# EAGLE schematic Nutrient Control Board-B1 (EAGLE 9.3.2)
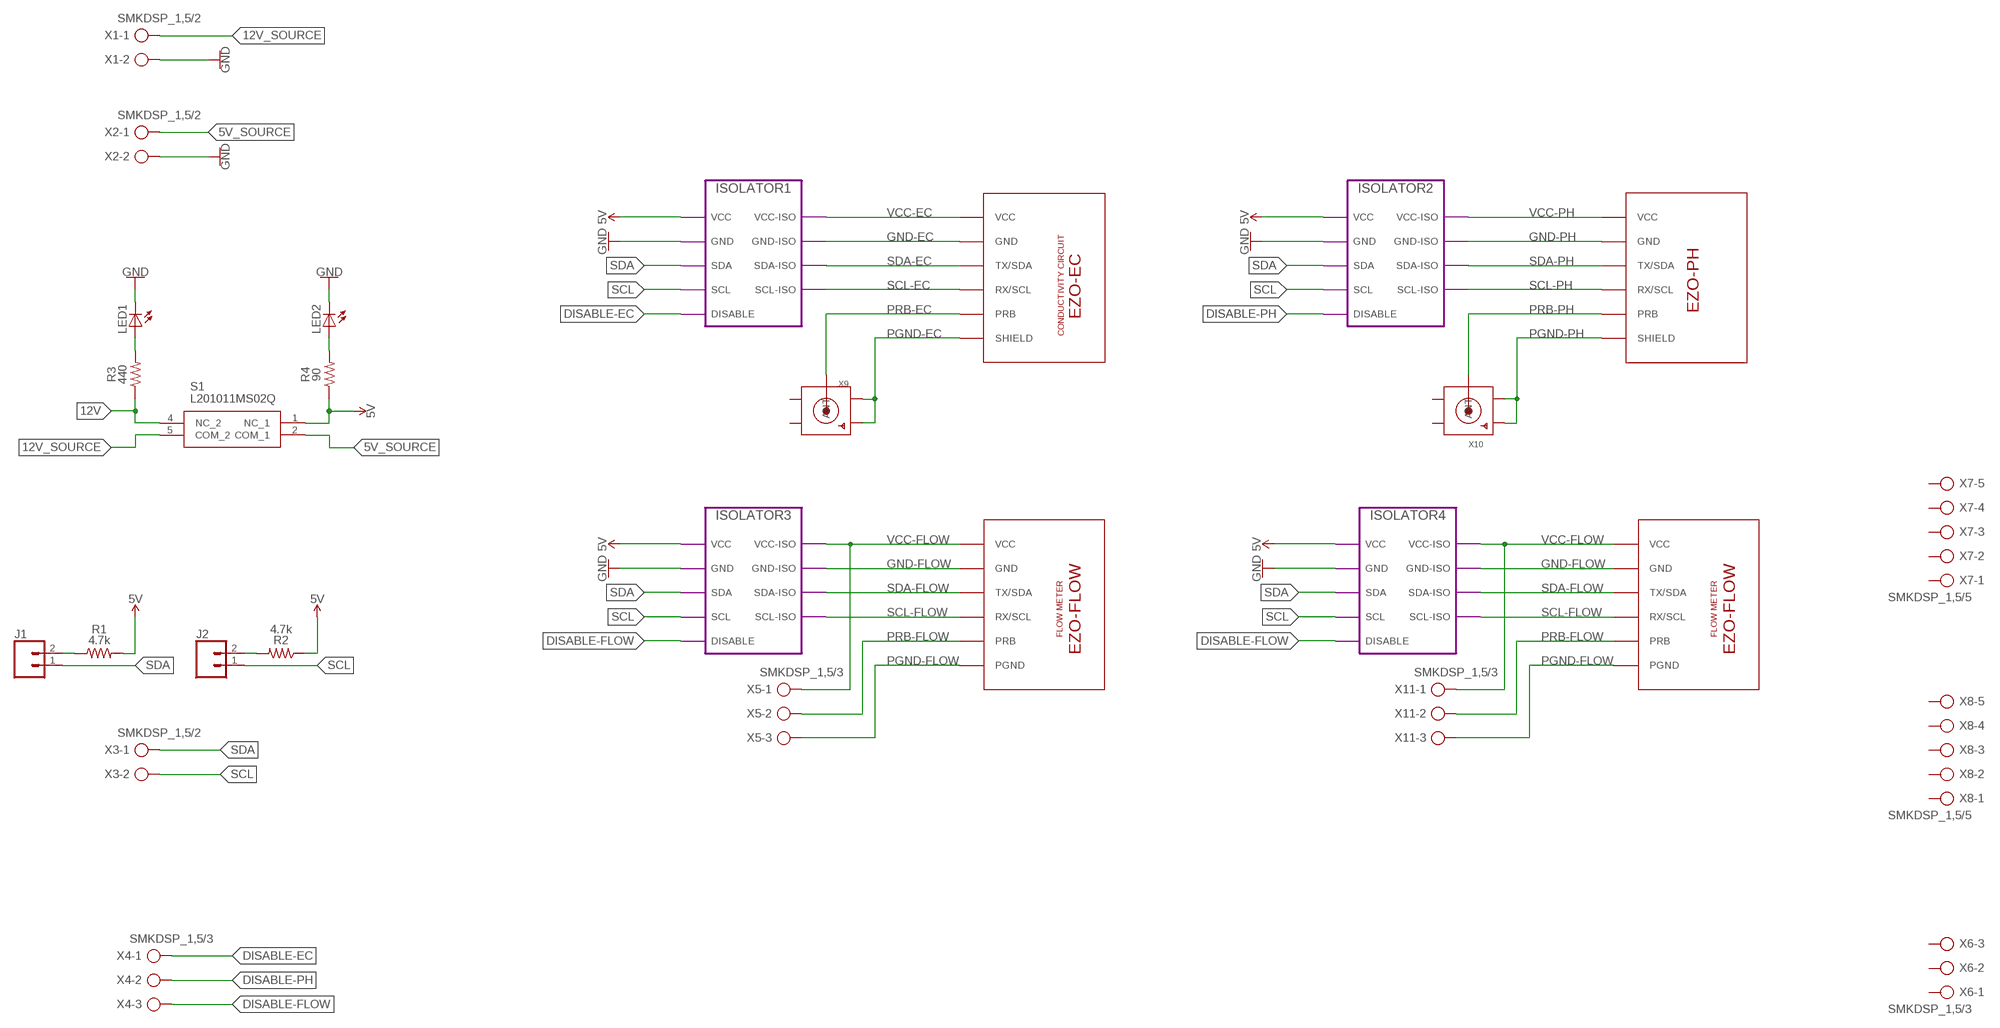
[diagram p0: schematic, sheet 1]

## Parts
J1  CONN_02  [1X02]
J2  CONN_02  [1X02]
LED1  LED5MM  [LED5MM]
LED2  LED5MM  [LED5MM]
R1  4.7k  4.7KOHM-0603-1/10W-1%  [0603]
R2  4.7k  4.7KOHM-0603-1/10W-1%  [0603]
R3  440  4.7KOHM-0603-1/10W-1%  [0603]
R4  90  4.7KOHM-0603-1/10W-1%  [0603]
S1  L201011MS02Q  [L201011MS02Q]
U$1  EZO-EC  [EZO-EC]
U$2  EZO-FLOW  [EZO-FLOW]
U$3  EZO-PH  [EZO-PH]
U$4  EZO-FLOW  [EZO-FLOW]
X1  SMKDSP_1,5/2  [SMKDSP_1,5/2]
X2  SMKDSP_1,5/2  [SMKDSP_1,5/2]
X3  SMKDSP_1,5/2  [SMKDSP_1,5/2]
X4  SMKDSP_1,5/3  [SMKDSP_1,5/3]
X5  SMKDSP_1,5/3  [SMKDSP_1,5/3]
X6  SMKDSP_1,5/3  [SMKDSP_1,5/3]
X7  SMKDSP_1,5/5  [SMKDSP_1,5/5]
X8  SMKDSP_1,5/5  [SMKDSP_1,5/5]
X9  SMACONNECTOR  [SMA90_DIP]
X10  SMACONNECTOR  [SMA90_DIP]
X11  SMKDSP_1,5/3  [SMKDSP_1,5/3]

## Module instances
ISOLATOR1 = ISOLATOR
ISOLATOR2 = ISOLATOR
ISOLATOR3 = ISOLATOR
ISOLATOR4 = ISOLATOR

## Nets
5V: R1.2 R2.1 R4.1 S1.1(NC_1) ; port ISOLATOR1.VCC ISOLATOR2.VCC ISOLATOR3.VCC ISOLATOR4.VCC
5V_SOURCE: S1.2(COM_1) X2.1
12V: R3.1 S1.4(NC_2)
12V_SOURCE: S1.5(COM_2) X1.1
DISABLE-EC: X4.1 ; port ISOLATOR1.DISABLE
DISABLE-FLOW: X4.3 ; port ISOLATOR3.DISABLE ISOLATOR4.DISABLE
DISABLE-PH: X4.2 ; port ISOLATOR2.DISABLE
GND: LED1.K(C) LED2.K(C) X1.2 X2.2 ; port ISOLATOR1.GND ISOLATOR2.GND ISOLATOR3.GND ISOLATOR4.GND
GND-EC: U$1.GND ; port ISOLATOR1.GND-ISO
GND-FLOW: U$2.GND U$4.GND ; port ISOLATOR3.GND-ISO ISOLATOR4.GND-ISO
GND-PH: U$3.GND ; port ISOLATOR2.GND-ISO
N$1: J1.2 R1.1
N$2: J2.2 R2.2
N$3: LED1.A R3.2
N$4: LED2.A R4.2
PGND-EC: U$1.SHIELD X9.GND1 X9.GND2
PGND-FLOW: U$2.PGND U$4.PGND X5.3 X11.3
PGND-PH: U$3.SHIELD X10.GND1 X10.GND2
PRB-EC: U$1.PRB X9.ANTENNA(ANT)
PRB-FLOW: U$2.PRB U$4.PRB X5.2 X11.2
PRB-PH: U$3.PRB X10.ANTENNA(ANT)
SCL: J2.1 X3.2 ; port ISOLATOR1.SCL ISOLATOR3.SCL ISOLATOR2.SCL ISOLATOR4.SCL
SCL-EC: U$1.RX/SCL ; port ISOLATOR1.SCL-ISO
SCL-FLOW: U$2.RX/SCL U$4.RX/SCL ; port ISOLATOR3.SCL-ISO ISOLATOR4.SCL-ISO
SCL-PH: U$3.RX/SCL ; port ISOLATOR2.SCL-ISO
SDA: J1.1 X3.1 ; port ISOLATOR1.SDA ISOLATOR3.SDA ISOLATOR2.SDA ISOLATOR4.SDA
SDA-EC: U$1.TX/SDA ; port ISOLATOR1.SDA-ISO
SDA-FLOW: U$2.TX/SDA U$4.TX/SDA ; port ISOLATOR3.SDA-ISO ISOLATOR4.SDA-ISO
SDA-PH: U$3.TX/SDA ; port ISOLATOR2.SDA-ISO
VCC-EC: U$1.VCC ; port ISOLATOR1.VCC-ISO
VCC-FLOW: U$2.VCC U$4.VCC X5.1 X11.1 ; port ISOLATOR3.VCC-ISO ISOLATOR4.VCC-ISO
VCC-PH: U$3.VCC ; port ISOLATOR2.VCC-ISO
Unconnected: X6.1 X6.2 X6.3 X7.1 X7.2 X7.3 X7.4 X7.5 X8.1 X8.2 X8.3 X8.4 X8.5

## Power pins joined to a net without a drawn wire
GND3: X9.GND3 X10.GND3
GND4: X9.GND4 X10.GND4

## Library data of the parts
J1 J2 = SparkFun-Connectors:CONN_02: Multi connection point. Often used as Generic Header-pin footprint for 0.1 inch spaced/style header connections On any of the 0.1 inch spaced packages, you can populate with these: Break Away Headers - Straight <https://www.sparkfun.com/products/116> (PRT-00116) Break Away Male Headers - Right Angle <https://www.sparkfun.com/products/553> (PRT-00553) Female Headers <https://www.sparkfun.com/products/115> (PRT-00115) Break Away Headers - Machine Pin <https://www.sparkfun.com/products/117> (PRT-00117) Break Away Female Headers - Swiss Machine Pin <https://www.sparkfun.com/products/743> (PRT-00743) For SCREWTERMINALS and SPRING TERMINALS visit here: Screw Terimnals on SparkFun.com <https://www.sparkfun.com/search/results?term=Screw+Terminals> (5mm/3.5mm/2.54mm spacing) This device is also useful as a general connection point to wire up your design to another part of your project. Our various solder wires solder well into these plated through hole pads. Hook-Up Wire - Assortment (Stranded, 22 AWG) <https://www.sparkfun.com/products/11375> (PRT-11375) Hook-Up Wire - Assortment (Solid Core, 22 AWG) <https://www.sparkfun.com/products/11367> (PRT-11367) View the entire wire category on our website here <https://www.sparkfun.com/categories/141> Special notes: Molex polarized connector foot print use with: PRT-08233 with associated crimp pins and housings. 2.54_SCREWTERM for use with PRT-10571. 3.5mm Screw Terminal footprints for PRT-08084 5mm Screw Terminal footprints for use with PRT-08432
LED1 LED2 = adafruit:LED: LED OSRAM: - CHIPLED LG R971, LG N971, LY N971, LG Q971, LY Q971, LO R971, LY R971 LH N974, LH R974 LS Q976, LO Q976, LY Q976 LO Q996 - Hyper CHIPLED LW Q18S LB Q993, LB Q99A, LB R99A - SideLED LS A670, LO A670, LY A670, LG A670, LP A670 LB A673, LV A673, LT A673, LW A673 LH A674 LY A675 LS A676, LA A676, LO A676, LY A676, LW A676 LS A679, LY A679, LG A679 - Hyper Micro SIDELED® LS Y876, LA Y876, LO Y876, LY Y876 LT Y87S - SmartLED LW L88C, LW L88S LB L89C, LB L89S, LG L890 LS L89K, LO L89K, LY L89K LS L896, LA L896, LO L896, LY L896 - TOPLED LS T670, LO T670, LY T670, LG T670, LP T670 LSG T670, LSP T670, LSY T670, LOP T670, LYG T670 LG T671, LOG T671, LSG T671 LB T673, LV T673, LT T673, LW T673 LH T674 LS T676, LA T676, LO T676, LY T676, LB T676, LH T676, LSB T676, LW T676 LB T67C, LV T67C, LT T67C, LS T67K, LO T67K, LY T67K, LW E67C LS E67B, LA E67B, LO E67B, LY E67B, LB E67C, LV E67C, LT E67C LW T67C LS T679, LY T679, LG T679 LS T770, LO T770, LY T770, LG T770, LP T770 LB T773, LV T773, LT T773, LW T773 LH T774 LS E675, LA E675, LY E675, LS T675 LS T776, LA T776, LO T776, LY T776, LB T776 LHGB T686 LT T68C, LB T68C - Hyper Mini TOPLED® LB M676 - Mini TOPLED Santana® LG M470 LS M47K, LO M47K, LY M47K Source: http://www.osram.convergy.de/
R1 R2 = SparkFun-Resistors:4.7KOHM: 4.7kΩ resistor A resistor is a passive two-terminal electrical component that implements electrical resistance as a circuit element. Resistors act to reduce current flow, and, at the same time, act to lower voltage levels within circuits. - Wikipedia; PROD_ID: RES-07857
R3 R4 = SparkFun-Resistors:4.7KOHM: 4.7kΩ resistor A resistor is a passive two-terminal electrical component that implements electrical resistance as a circuit element. Resistors act to reduce current flow, and, at the same time, act to lower voltage levels within circuits. - Wikipedia; PROD_ID: RES-07857; VALUE: 4.7k
S1 = L201011MS02Q:L201011MS02Q: Slide Switches Source: Datasheet; DESCRIPTION: Slide Switches; HEIGHT: 14.18mm; MANUFACTURER_NAME: C & K COMPONENTS; MANUFACTURER_PART_NUMBER: L201011MS02Q; MOUSER_PART_NUMBER: 611-L201011MS02Q; MOUSER_PRICE-STOCK: https://www.mouser.co.uk/ProductDetail/CK/L201011MS02Q?qs=LgMIjt8LuD%252BoYkDPMhMLsg%3D%3D
U$1 = EZO:EZO-EC
U$2 U$4 = EZO:EZO-FLOW
U$3 = EZO:EZO-PH
X1-X3 = con-phoenix-smkdsp:SMKDSP_1,5/2: Printklemme, Nennstrom: 17,5 A, Bemessungsspannung: 250 V, Raster: 5,0 mm Source: http://eshop.phoenixcontact.de .. 1733415.pdf; MF: FARNELL; MPN: 1733570; OC_FARNELL: 3041244; OC_NEWARK: 69C8588
X4-X6 X11 = con-phoenix-smkdsp:SMKDSP_1,5/3: Printklemme, Nennstrom: 17,5 A, Bemessungsspannung: 250 V, Raster: 5,0 mm Source: http://eshop.phoenixcontact.de .. 1733415.pdf; MF: FARNELL; MPN: 1733583; OC_FARNELL: 3041256; OC_NEWARK: 71C4130
X7 X8 = con-phoenix-smkdsp:SMKDSP_1,5/5: Printklemme, Nennstrom: 17,5 A, Bemessungsspannung: 250 V, Raster: 5,0 mm Source: http://eshop.phoenixcontact.de .. 1733415.pdf; OC_FARNELL: unknown; OC_NEWARK: unknown
X9 X10 = adafruit:SMACONNECTOR: SMA Connector 90° DIP SMA Connector, 50 Ohm (4UConnector: 07259)

## Module ISOLATOR
Ports: VCC(io) GND(io) VCC-ISO(io) GND-ISO(io) SCL-ISO(io) SDA-ISO(io) SCL(io) SDA(io) DISABLE(io)
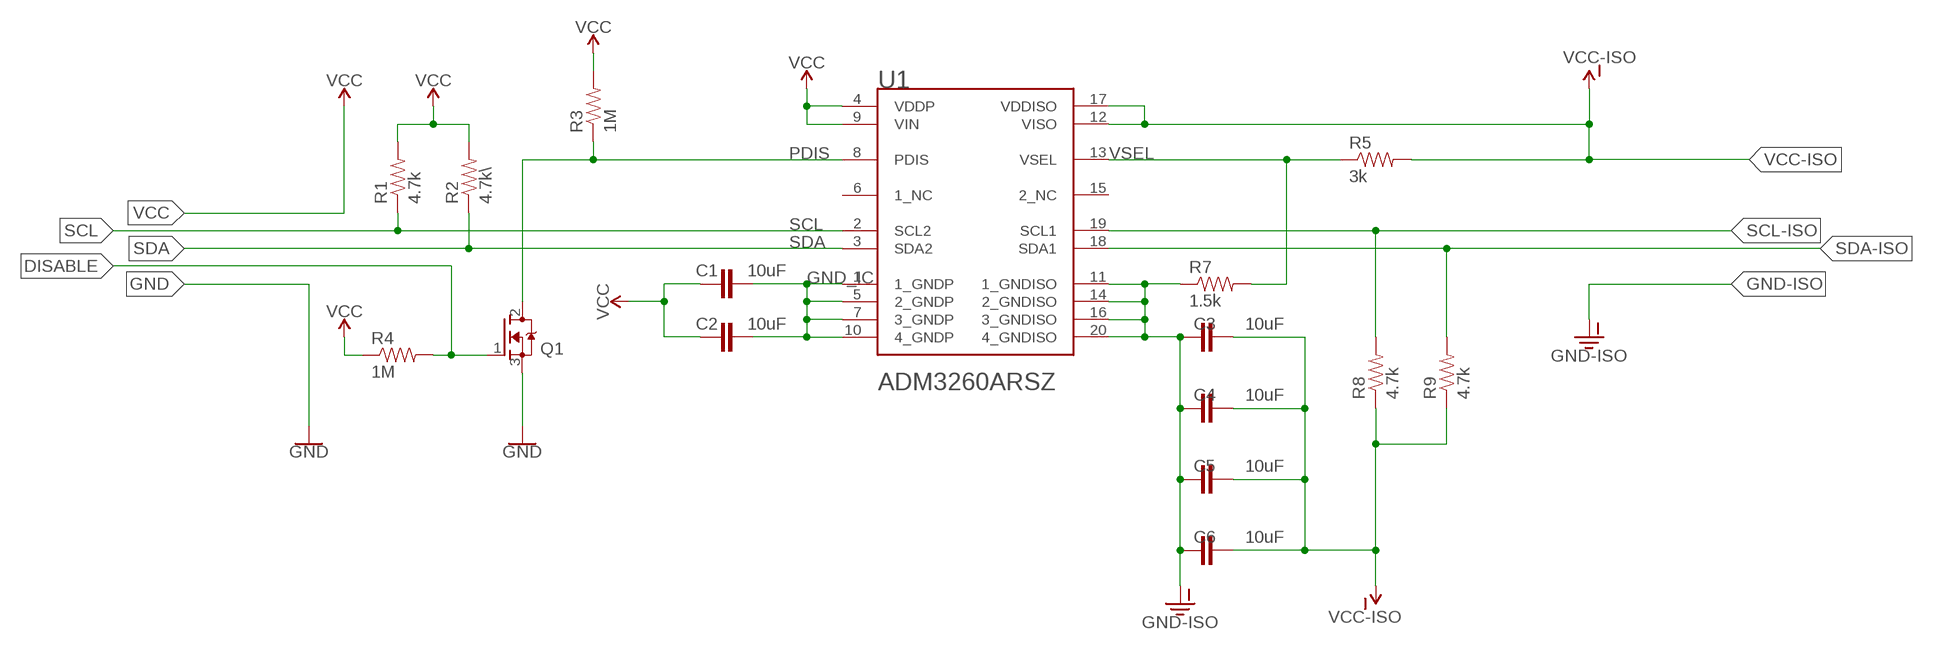
[diagram p1: schematic, module ISOLATOR, sheet 1]

### Parts
C1  10uF  22PF-PTH-2.54MM-200V-5%  [CAP-PTH-2.54]
C2  10uF  22PF-PTH-2.54MM-200V-5%  [CAP-PTH-2.54]
C3  10uF  22PF-PTH-2.54MM-200V-5%  [CAP-PTH-2.54]
C4  10uF  22PF-PTH-2.54MM-200V-5%  [CAP-PTH-2.54]
C5  10uF  22PF-PTH-2.54MM-200V-5%  [CAP-PTH-2.54]
C6  10uF  22PF-PTH-2.54MM-200V-5%  [CAP-PTH-2.54]
Q1  MOSFET-NGDS_TO220V  [TO220V]
R1  4.7k  1MOHM-HORIZ-1/4W-5%  [AXIAL-0.3]
R2  4.7k\  1MOHM-HORIZ-1/4W-5%  [AXIAL-0.3]
R3  1M  1MOHM-HORIZ-1/4W-5%  [AXIAL-0.3]
R4  1M  1MOHM-HORIZ-1/4W-5%  [AXIAL-0.3]
R5  3k  1MOHM-HORIZ-1/4W-5%  [AXIAL-0.3]
R7  1.5k  1MOHM-HORIZ-1/4W-5%  [AXIAL-0.3]
R8  4.7k  1MOHM-HORIZ-1/4W-5%  [AXIAL-0.3]
R9  4.7k  1MOHM-HORIZ-1/4W-5%  [AXIAL-0.3]
U1  ANALOG_DEVICES_INC_ADM3260ARSZANALOG_DEVICES_INC_ADM3260ARSZ_0_0  [ANALOG_DEVICES_INC_ADM3260ARSZ_0]

### Nets
DISABLE: Q1.1(G) R4.P$2
GND: Q1.3(S)
GND-ISO: C3.1 C4.1 C5.1 C6.1 R7.P$1 U1.11(1_GNDISO) U1.14(2_GNDISO) U1.16(3_GNDISO) U1.20(4_GNDISO)
GND_IC: C1.2 C2.2 U1.1(1_GNDP) U1.5(2_GNDP) U1.7(3_GNDP) U1.10(4_GNDP)
PDIS: Q1.2(D) R3.P$1 U1.8(PDIS)
SCL: R1.P$1 U1.2(SCL2)
SCL-ISO: R8.P$2 U1.19(SCL1)
SDA: R2.P$1 U1.3(SDA2)
SDA-ISO: R9.P$2 U1.18(SDA1)
VCC: C1.1 C2.1 R1.P$2 R2.P$2 R3.P$2 R4.P$1 U1.4(VDDP) U1.9(VIN)
VCC-ISO: C3.2 C4.2 C5.2 C6.2 R5.P$2 R8.P$1 R9.P$1 U1.12(VISO) U1.17(VDDISO)
VSEL: R5.P$1 R7.P$2 U1.13(VSEL)
Unconnected: U1.6(1_NC) U1.15(2_NC)

### Library data of the parts
C1-C6 = SparkFun-Capacitors:22PF: 22pF ceramic capacitors A capacitor is a passive two-terminal electrical component used to store electrical energy temporarily in an electric field.; PROD_ID: CAP-09128; VALUE: 22pF
Q1 = adafruit:MOSFET-N: N-Channel Mosfet 2N7002E - 60V 260mA SOT23 [Digikey: 2N7002ET1GOSTR-ND] - REEL BSH103 - 30V 850mA SOT23 [Digikey: 568-5013-1-ND]
R1 R2 R5 R7-R9 = SparkFun-Resistors:1MOHM: 1MΩ resistor A resistor is a passive two-terminal electrical component that implements electrical resistance as a circuit element. Resistors act to reduce current flow, and, at the same time, act to lower voltage levels within circuits. - Wikipedia; PROD_ID: RES-09329; VALUE: 1M
R3 R4 = SparkFun-Resistors:1MOHM: 1MΩ resistor A resistor is a passive two-terminal electrical component that implements electrical resistance as a circuit element. Resistors act to reduce current flow, and, at the same time, act to lower voltage levels within circuits. - Wikipedia; PROD_ID: RES-09329
U1 = Analog Devices Inc - ADM3260ARSZ:ANALOG_DEVICES_INC_ADM3260ARSZ: Digital Isolator, 2 Channel, 3 V, 5.5 V, SSOP, 20 Pins; AMBIENT_TEMPERATURE_RANGE_HIGH: +105°C; AMBIENT_TEMPERATURE_RANGE_LOW: -40°C; CENTROID_NOT_SPECIFIED: No; DATASHEET: http://www.analog.com/media/en/technical-documentation/data-sheets/ADM3260.pdf; DEVICE_CLASS_L1: Integrated Circuits (ICs); DEVICE_CLASS_L2: Power Management ICs; DEVICE_CLASS_L3: Hot Swap Controllers; DIGIKEY_DESCRIPTION: IC DGTL ISO 2.5KV 2CH I2C 20SSOP; DIGIKEY_PART_NUMBER: ADM3260ARSZ-ND; FOOTPRINT_PARAMETERS_0: {"fp_type":"SSOP","params":{"N":{"nom":20,"long name":"Number of leads","min":null,"max":null,"short name":"N","type":"count"},"A":{"nom":false,"long name":"Height","min":false,"max":2000000,"short name":"A","type":"measurement"},"A1":{"nom":false,"long name":"Package clearance","min":50000,"max":false,"short name":"A1","type":"measurement"},"A2":{"nom":1750000,"long name":"Package height","min":1650000,"max":1850000,"short name":"A2","type":"measurement"},"E":{"nom":7800000,"long name":"Width /w leads","min":7400000,"max":8200000,"short name":"E","type":"measurement"},"E1":{"nom":5300000,"long name":"Package width","min":5000000,"max":5600000,"short name":"E1","type":"measurement"},"D":{"nom":7200000,"long name":"Package length","min":6900000,"max":7500000,"short name":"D","type":"measurement"},"B":{"nom":false,"long name":"Lead width","min":220000,"max":380000,"short name":"B","type":"measurement"},"C":{"nom":false,"long name":"Lead thickness","min":90000,"max":250000,"short name":"C","type":"measurement"},"L":{"nom":750000,"long name":"Lead foot length","min":550000,"max":950000,"short name":"L","type":"measurement"},"e":{"nom":650000,"long name":"Lead pitch","min":null,"max":null,"short name":"e","type":"measurement"},"PHI":{"nom":false,"long name":"Lead angle","min":0,"max":8,"short name":"PHI","type":"measurement"},"HT":{"default":"No","long name":"Thermal pad","type":"multichoiceparent","short name":"HT","children":[]},"offset x":{"nom":0,"long name":"X Center offset","min":null,"max":null,"short name":"offset x","type":"measurement"},"offset y":{"nom":0,"long name":"Y Center offset","min":null,"max":null,"short name":"offset y","type":"measurement"},"LS":{"default":"Rounded rectangle","long name":"Land shape","type":"multichoice","short name":"LS"},"LS1":{"default":"Rectangle","long name":"Land shape (Pin 1)","type":"multichoice","short name":"LS1"},"solder toe":{"nom":150000,"long name":"Solder fillet (toe)","min":null,"max":null,"short name":"solder toe","type":"fixedmeasurement"},"solder heel":{"nom":250000,"long name":"Solder fillet (heel)","min":null,"max":null,"short name":"solder heel","type":"fixedmeasurement"},"solder side":{"nom":10000,"long name":"Solder fillet (side)","min":null,"max":null,"short name":"solder side","type":"fixedmeasurement"},"courtyard":{"nom":100000,"long name":"Courtyard","min":null,"max":null,"short name":"courtyard","type":"fixedmeasurement"},"SF":{"default":"C","long name":"Packing level","type":"multichoiceparent","short name":"SF","help":"http://support.upverter.com/customer/portal/articles/978783-what-is-a-footprint-packing-level","children":["solder toe","solder heel","solder side","courtyard"]}}}; HEIGHT: 2mm; IPC_LAND_PATTERN_NAME: SOP65P780X200-20; LEAD_FREE: yes; MAX_SUPPLY_VOLTAGE: 5.5V; MF: Analog Devices Inc; MFG_PACKAGE_IDENT: RS-20; MFG_PACKAGE_IDENT_DATE: 0; MFG_PACKAGE_IDENT_REV: A; MIN_SUPPLY_VOLTAGE: 3V; MOUSER_DESCRIPTION: Digital Isolators Iso, Dual I2C w/DC to DC conv; MOUSER_PART_NUMBER: 584-ADM3260ARSZ; MPN: ADM3260ARSZ; NUMBER_OF_CHANNELS: 2; NUMBER_OF_OUTPUTS: 2; OUTPUT_CURRENT: 30mA; OUTPUT_VOLTAGE: 3-5.5V; PACKAGE: SSOP20; PIN_0_0_3_INSIDE_EDGE: clock; PIN_0_0_4_INSIDE_EDGE: clock; PREFIX: U; ROHS: yes; STANDOFF_HEIGHT: 0.05mm; TEMPERATURE_RANGE_HIGH: +105°C; TEMPERATURE_RANGE_LOW: -40°C; VERIFICATION_VERSION: 0.0.0.1